# Altium project C210 Rev_B_220601.PrjPcb (part 2 of 5)

## Sheet C210_0003_SARA_Module_220601.SchDoc: C210_0003_SARA_Module
size B; Date: 2/26/2021; CompanyName: U-blox; DrawnBy: EMOO; Engineer: EMOO; Organization: U-blox; Address1: 2601 25th St. SE; Address2: Salem, OR 97302; SheetNumber: 3; SheetTotal: 7; Website: www.u-blox.com; SheetSize: B; SheetTitle: C-210 SARA Module
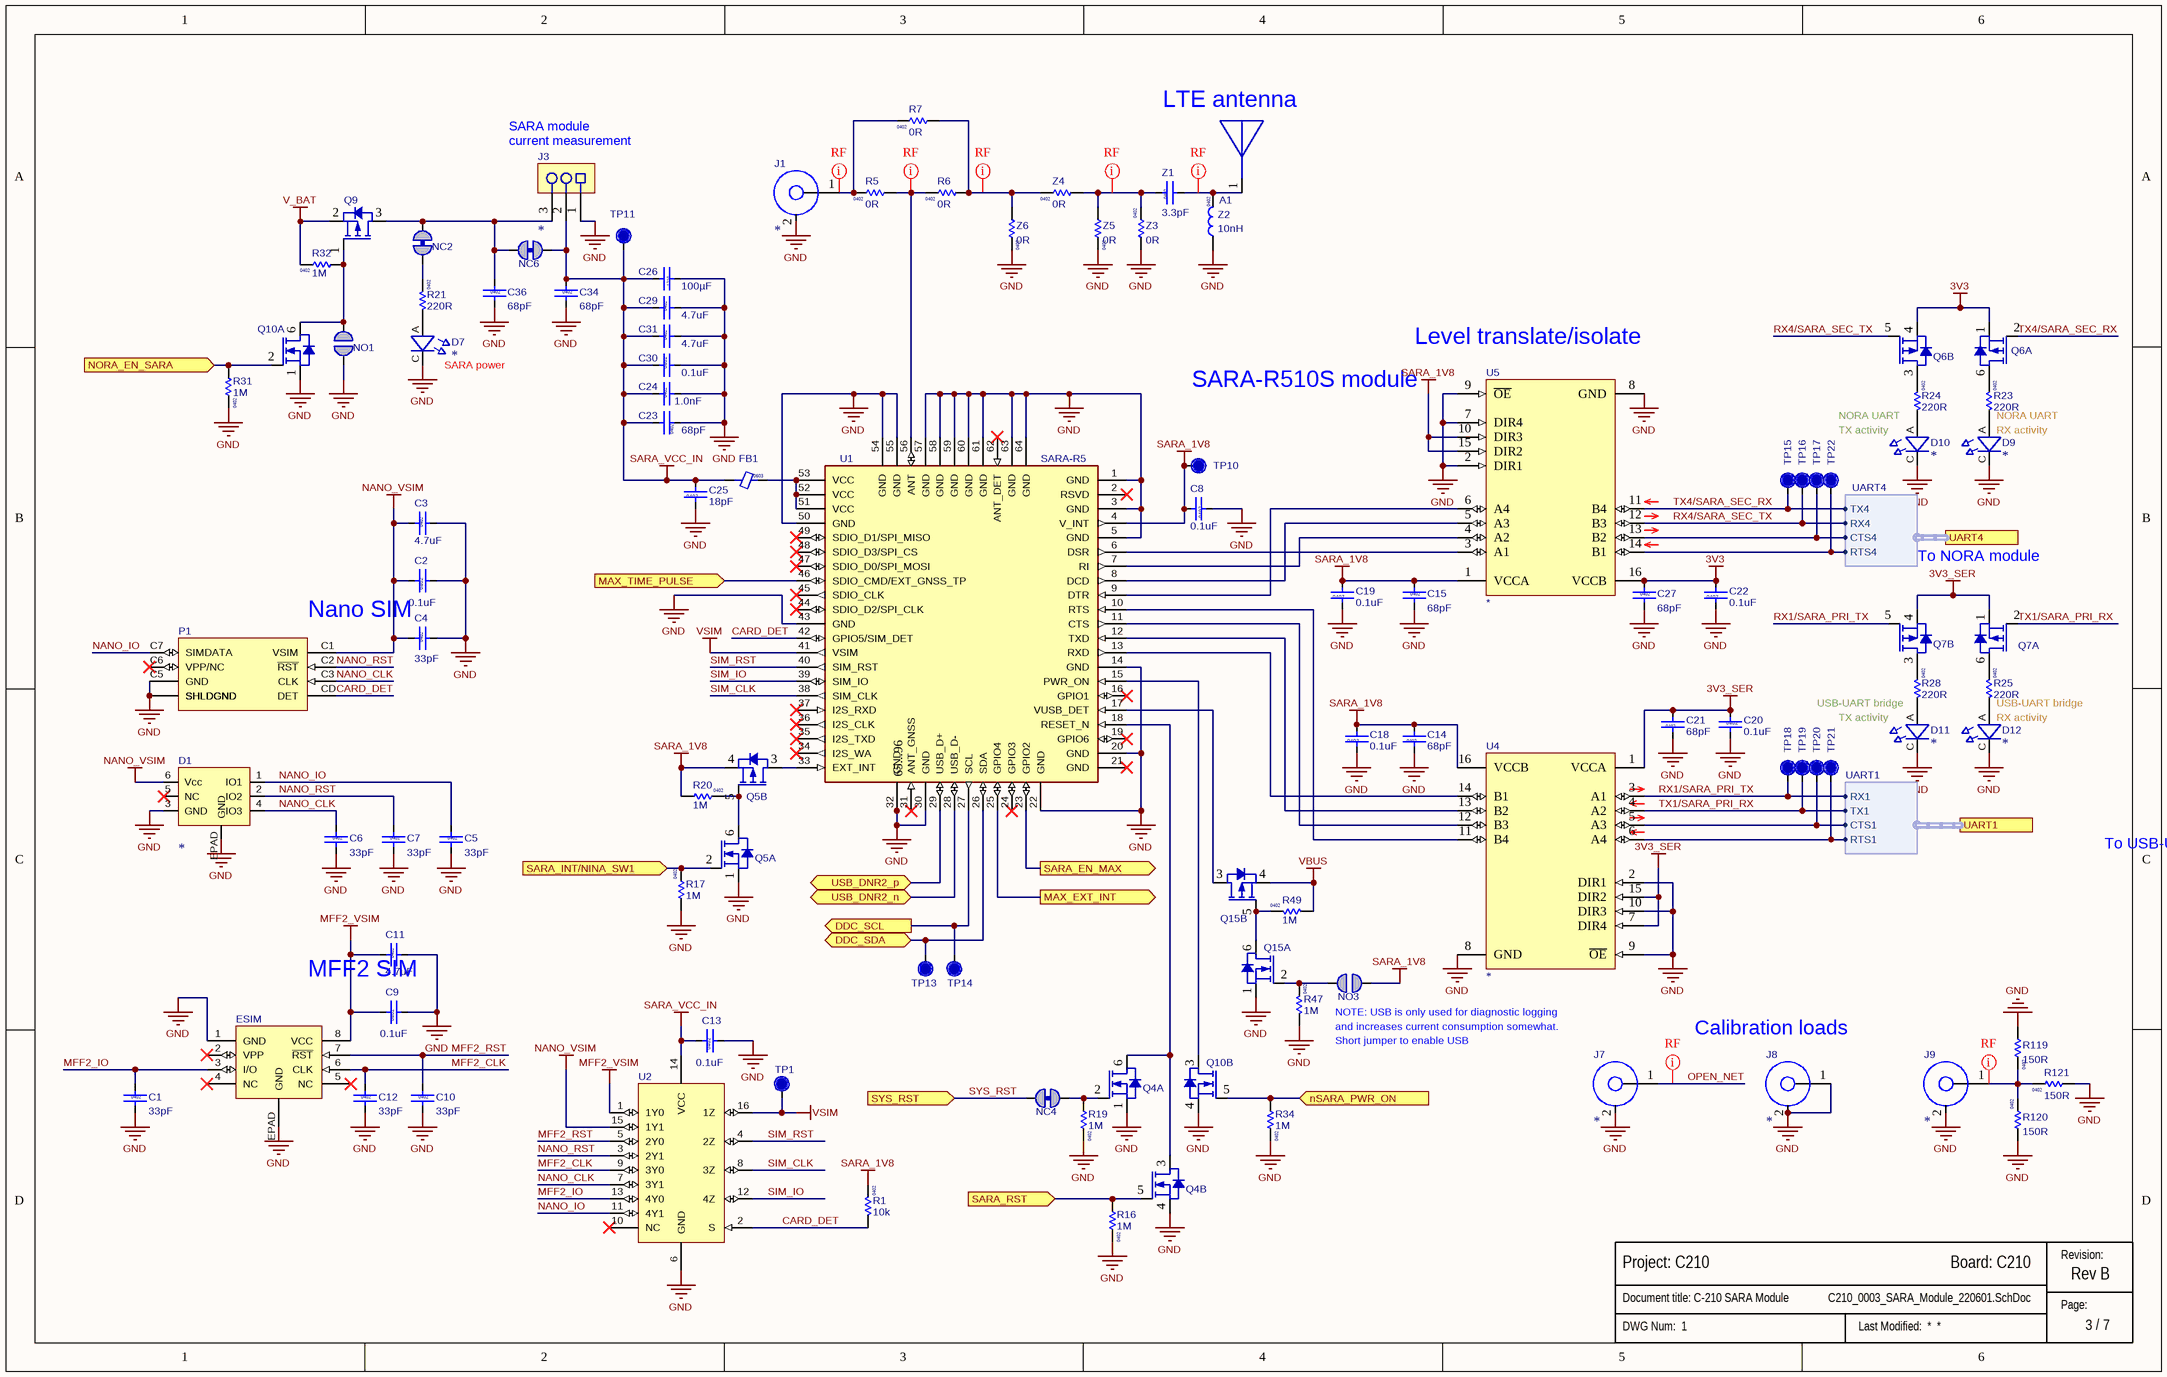
[diagram p2: C210_0003_SARA_Module_220601.SchDoc]

### Parts
(Parts that share a designator on the sheet are numbered #1, #2 ... from top to bottom, then left to right.)
?#4  (no value)  (graphical)
A1  PCS.66.A  [PCS_66_A]  (value not drawn)
C1  value 33pF  Size: 0402  [Cap 0402 HD]
C2  value 0.1uF  Size: 0402  [Cap 0402 HD]  (hidden comment: 120-000160.1uF)
C3  value 4.7uF  Size: 0402  [Cap 0402 HD]
C4  value 33pF  Size: 0402  [Cap 0402 HD]
C5  value 33pF  Size: 0402  [Cap 0402 HD]
C6  value 33pF  Size: 0402  [Cap 0402 HD]
C7  value 33pF  Size: 0402  [Cap 0402 HD]
C8  value 0.1uF  Size: 0402  [Cap 0402 HD]  (hidden comment: 120-000160.1uF)
C9  value 0.1uF  Size: 0402  [Cap 0402 HD]  (hidden comment: 120-000160.1uF)
C10  value 33pF  Size: 0402  [Cap 0402 HD]
C11  value 4.7uF  Size: 0402  [Cap 0402 HD]
C12  value 33pF  Size: 0402  [Cap 0402 HD]
C13  value 0.1uF  Size: 0402  [Cap 0402 HD]  (hidden comment: 120-000160.1uF)
C14  value 68pF  Size: 0402  [Cap 0402 HD]
C15  value 68pF  Size: 0402  [Cap 0402 HD]
C18  value 0.1uF  Size: 0402  [Cap 0402 HD]  (hidden comment: 120-000160.1uF)
C19  value 0.1uF  Size: 0402  [Cap 0402 HD]  (hidden comment: 120-000160.1uF)
C20  value 0.1uF  Size: 0402  [Cap 0402 HD]  (hidden comment: 120-000160.1uF)
C21  value 68pF  Size: 0402  [Cap 0402 HD]
C22  value 0.1uF  Size: 0402  [Cap 0402 HD]  (hidden comment: 120-000160.1uF)
C23  value 68pF  Size: 0402  [Cap 0402 HD]
C24  value 1.0nF  Size: 0402  [Cap 0402 HD]
C25  value 18pF  Size: 0402  [Cap 0402 HD]
C26  value 100µF  Size: 1210  [Cap 1210]
C27  value 68pF  Size: 0402  [Cap 0402 HD]
C29  value 4.7uF  Size: 0402  [Cap 0402 HD]
C30  value 0.1uF  Size: 0402  [Cap 0402 HD]  (hidden comment: 120-000160.1uF)
C31  value 4.7uF  Size: 0402  [Cap 0402 HD]
C34  value 68pF  Size: 0402  [Cap 0402 HD]
C36  value 68pF  Size: 0402  [Cap 0402 HD]
D1  (no value)  [TPD3E001DRSR]
D7  (no value)  [LTST-C190EKT]
D9  (no value)  [LTST-C190YKT]
D10  (no value)  [LTST-C190KGKT]
D11  (no value)  [LTST-C190KGKT]
D12  (no value)  [LTST-C190YKT]
ESIM  (no value)  [MFF2 SIM]
FB1  Size: 0603  [BLM18EG221SN1]
J1  (no value)  [U.FL_3Pin]
J3  (no value)  [HDR-0.1P-3Pin-1Row-SMT]
J7  (no value)  [U.FL_3Pin]
J8  (no value)  [U.FL_3Pin]
J9  (no value)  [U.FL_3Pin]
NC2  Solderbridge-ShortDNP  [Solderbridge-Short]  (value not drawn)  (net tie, no BOM)
NC4  Solderbridge-ShortDNP  [Solderbridge-Short]  (value not drawn)  (net tie, no BOM)
NC6  Solderbridge-ShortDNP  [Solderbridge-Short]  (value not drawn)  (net tie, no BOM)
NO1  Solderbridge-OpenDNP  [Solderbridge-Open]  (value not drawn)  (no BOM)
NO3  Solderbridge-OpenDNP  [Solderbridge-Open]  (value not drawn)  (no BOM)
P1  (no value)  [SIM6065-6-1-14-01-A]
Q4  (no value)  [SOT-563]  (parts A,B of 2)
Q5  (no value)  [SOT-563]  (parts A,B of 2)
Q6  (no value)  [FDY2000PZ]  (parts A,B of 2)
Q7  (no value)  [FDY2000PZ]  (parts A,B of 2)
Q9  (no value)  [SOT-23]
Q10  (no value)  [SOT-563]  (parts A,B of 2)
Q15  (no value)  [SOT-563]  (parts A,B of 2)
R1  value 10k  Size: 0402  [RES 0402 HD]
R5  value 0R  Size: 0402  [RES 0402 HD]
R6  value 0R  Size: 0402  [RES 0402 HD]
R7  value 0R  Size: 0402  [RES 0402 HD]
R16  value 1M  Size: 0402  [RES 0402 HD]
R17  value 1M  Size: 0402  [RES 0402 HD]
R19  value 1M  Size: 0402  [RES 0402 HD]
R20  value 1M  Size: 0402  [RES 0402 HD]
R21  value 220R  Size: 0402  [RES 0402 HD]
R23  value 220R  Size: 0402  [RES 0402 HD]
R24  value 220R  Size: 0402  [RES 0402 HD]
R25  value 220R  Size: 0402  [RES 0402 HD]
R28  value 220R  Size: 0402  [RES 0402 HD]
R31  value 1M  Size: 0402  [RES 0402 HD]
R32  value 1M  Size: 0402  [RES 0402 HD]
R34  value 1M  Size: 0402  [RES 0402 HD]
R47  value 1M  Size: 0402  [RES 0402 HD]
R49  value 1M  Size: 0402  [RES 0402 HD]
R119  value 150R  Size: 0402  [RES 0402 HD]
R120  value 150R  Size: 0402  [RES 0402 HD]
R121  value 150R  Size: 0402  [RES 0402 HD]
TP1  TP  [TP12R]  (value not drawn)  (no BOM)
TP10  TP  [TP12R]  (value not drawn)  (no BOM)
TP11  TP  [TP12R]  (value not drawn)  (no BOM)
TP13  TP  [TP12R]  (value not drawn)  (no BOM)
TP14  TP  [TP12R]  (value not drawn)  (no BOM)
TP15  TP  [TP12R]  (value not drawn)  (no BOM)
TP16  TP  [TP12R]  (value not drawn)  (no BOM)
TP17  TP  [TP12R]  (value not drawn)  (no BOM)
TP18  TP  [TP12R]  (value not drawn)  (no BOM)
TP19  TP  [TP12R]  (value not drawn)  (no BOM)
TP20  TP  [TP12R]  (value not drawn)  (no BOM)
TP21  TP  [TP12R]  (value not drawn)  (no BOM)
TP22  TP  [TP12R]  (value not drawn)  (no BOM)
U1  SARA-R5  [SARA-XX]
U2  (no value)  [XQFN-16]
U4  (no value)  [QFN0.5P2x6-16Pin_W-Pad]
U5  (no value)  [QFN0.5P2x6-16Pin_W-Pad]
Z1  value 3.3pF  Size: 0402  [Cap 0402 HD]
Z2  value 10nH  Size: 0402  [IND 0402]
Z3  value 0R  Size: 0402  [RES 0402 HD]
Z4  value 0R  Size: 0402  [RES 0402 HD]
Z5  value 0R  Size: 0402  [RES 0402 HD]
Z6  value 0R  Size: 0402  [RES 0402 HD]

### Ports
DDC_SCL (out), DDC_SDA (bidir), MAX_EXT_INT (out), MAX_TIME_PULSE (in), NORA_EN_SARA (in), nSARA_PWR_ON (in), SARA_EN_MAX (out), SARA_INT/NINA_SW1 (in), SARA_RST (in), SYS_RST (in), UART1 (harness UART1), UART4 (harness UART4), USB_DNR2_n (bidir), USB_DNR2_p (bidir)

### Harnesses
UART4: TX4, RX4, RTS4, CTS4
UART1: TX1, RX1, RTS1, CTS1

### Nets
3V3: C22.2 C27.1 Q6.1(S1) Q6.4(S2) U5.16(VCCB)
3V3_SER: C20.1 C21.2 Q7.1(S1) Q7.4(S2) U4.1(VCCA) U4.7(DIR4) U4.15(DIR2)
GND: C1.2 C2.2 C3.2 C4.2 C5.2 C6.2 C7.2 C8.1 C9.2 C10.2 C11.2 C12.2 C13.2 C14.1 C15.2 C18.1 C19.1 C20.2 C21.1 C22.1 C23.1 C24.2 C25.1 C26.1 C27.2 C29.2 C30.2 C31.2 C34.2 C36.2 D1.3(GND) D1.EPAD(GND) D7.C(Cathode) D9.C(Cathode) D10.C(Cathode) D11.C(Cathode) D12.C(Cathode) ESIM.1(GND) ESIM.EPAD(GND) J1.2 J3.1 J7.2 J8.1(ANT) J8.2 J9.2 NO1.2 P1.C5(GND) P1.G1(SHLDGND) P1.G2(SHLDGND) P1.G3(SHLDGND) P1.G4(SHLDGND) Q4.1(S1) Q4.4(S2) Q5.1(S1) Q10.1(S1) Q10.4(S2) Q15.1(S1) R16.2 R17.1 R19.2 R31.2 R34.2 R47.1 R119.1 R120.1 R121.1 U1.1(GND) U1.3(GND) U1.5(GND) U1.14(GND) U1.20(GND) U1.22(GND) U1.30(GND) U1.32(GND) U1.43(GND) U1.50(GND) U1.54(GND) U1.55(GND) U1.57(GND) U1.58(GND) U1.59(GND) U1.60(GND) U1.61(GND) U1.63(GND) U1.64(GND) U1.65(GND) U1.66(GND) U1.67(GND) U1.68(GND) U1.69(GND) U1.70(GND) U1.71(GND) U1.72(GND) U1.73(GND) U1.74(GND) U1.75(GND) U1.76(GND) U1.77(GND) U1.78(GND) U1.79(GND) U1.80(GND) U1.81(GND) U1.82(GND) U1.83(GND) U1.84(GND) U1.85(GND) U1.86(GND) U1.87(GND) U1.88(GND) U1.89(GND) U1.90(GND) U1.91(GND) U1.92(GND) U1.93(GND) U1.94(GND) U1.95(GND) U1.96(GND) U2.6(GND) U4.2(DIR1) U4.8(GND) U4.9(~{OE}) U4.10(DIR3) U5.2(DIR1) U5.7(DIR4) U5.8(GND) U5.9(~{OE}) Z2.1 Z3.1 Z5.2 Z6.2
MFF2_VSIM: C9.1 C11.1 ESIM.8(VCC) U2.1(1Y0)
NANO_VSIM: C2.1 C3.1 C4.1 D1.6(Vcc) P1.C1(VSIM) U2.15(1Y1)
SARA_1V8: C8.2 C14.2 C15.1 C18.2 C19.2 NO3.2 Q5.4(S2) R1.2 R20.1 TP10.1 U1.4(V_INT) U4.16(VCCB) U5.1(VCCA) U5.10(DIR3) U5.15(DIR2)
SARA_VCC_IN: C13.1 C23.2 C24.1 C25.2 C26.2 C29.1 C30.1 C31.1 C34.1 FB1.1 J3.2 NC6.1 TP11.1 U2.14(VCC)
V_BAT: Q9.2(S) R32.2
VBUS: Q15.4(S2) R49.1
VSIM: TP1.1 U1.41(VSIM) U2.16(1Z)
CARD_DET: P1.CD(DET) R1.1 U1.42(GPIO5/SIM_DET) U2.2(S)
CTS4: TP17.1 U5.13(B2) ; port UART4.CTS4
MFF2_CLK: C12.1 ESIM.6(CLK) U2.9(3Y0)
MFF2_IO: C1.1 ESIM.3(I/O) U2.13(4Y0)
MFF2_RST: C10.1 ESIM.7(~{RST}) U2.5(2Y0)
NANO_CLK: C6.1 D1.4(IO3) P1.C3(CLK) U2.7(3Y1)
NANO_IO: C5.1 D1.1(IO1) P1.C7(SIMDATA) U2.11(4Y1)
NANO_RST: C7.1 D1.2(IO2) P1.C2(~{RST}) U2.3(2Y1)
OPEN_NET: J7.1(ANT)
RTS4: TP22.1 U5.14(B1) ; port UART4.RTS4
RX1/SARA_PRI_TX: Q7.5(G2) TP18.1 U4.3(A1) ; port UART1.RX1
RX4/SARA_SEC_TX: Q6.5(G2) TP16.1 U5.12(B3) ; port UART4.RX4  [project net RX4]
SIM_CLK: U1.38(SIM_CLK) U2.8(3Z)
SIM_IO: U1.39(SIM_IO) U2.12(4Z)
SIM_RST: U1.40(SIM_RST) U2.4(2Z)
SYS_RST: NC4.2 ; port SYS_RST
TX1/SARA_PRI_RX: Q7.2(G1) TP19.1 U4.4(A2) ; port UART1.TX1
TX4/SARA_SEC_RX: Q6.2(G1) TP15.1 U5.11(B4) ; port UART4.TX4  [project net TX4]
USB_DNR2_n: U1.28(USB_D-) ; port USB_DNR2_n
USB_DNR2_p: U1.29(USB_D+) ; port USB_DNR2_p
NetA1_1: A1.1 Z1.2 Z2.2
NetC36_1: C36.1 J3.3 NC2.1 NC6.2 Q9.3(D)
NetD7_A: D7.A(Anode) R21.1
NetD9_A: D9.A(Anode) R23.1
NetD10_A: D10.A(Anode) R24.1
NetD11_A: D11.A(Anode) R28.1
NetD12_A: D12.A(Anode) R25.1
NetFB1_2: FB1.2 U1.51(VCC) U1.52(VCC) U1.53(VCC)
NetJ1_1: J1.1(ANT) R5.2 R7.2
NetJ9_1: J9.1(ANT) R119.2 R120.2 R121.2
NetNC2_2: NC2.2 R21.2
NetNC4_1: NC4.1 Q4.2(G1) R19.1
NetNO1_1: NO1.1 Q9.1(G) Q10.6(D1) R32.1
NetNO3_1: NO3.1 Q15.2(G1) R47.2
NetQ1_2: Q5.2(G1) R17.2 ; port SARA_INT/NINA_SW1
NetQ4_3: Q4.3(D2) Q4.6(D1) U1.18(RESET_N)
NetQ4_5: Q4.5(G2) R16.1 ; port SARA_RST
NetQ5_3: Q5.3(D2) U1.33(EXT_INT)
NetQ5_5: Q5.5(G2) Q5.6(D1) R20.2
NetQ6_3: Q6.3(D2) R24.2
NetQ6_6: Q6.6(D1) R23.2
NetQ7_3: Q7.3(D2) R28.2
NetQ7_6: Q7.6(D1) R25.2
NetQ10_2: Q10.2(G1) R31.1 ; port NORA_EN_SARA
NetQ10_3: Q10.3(D2) U1.15(PWR_ON)
NetQ10_5: Q10.5(G2) R34.1 ; port nSARA_PWR_ON
NetQ15_3: Q15.3(D2) U1.17(VUSB_DET)
NetQ15_5: Q15.5(G2) Q15.6(D1) R49.2
NetQ27_2: U1.23(GPIO2) ; port SARA_EN_MAX
NetR5_1: R5.1 R6.2 U1.56(ANT)
NetR6_1: R6.1 R7.1 Z4.2 Z6.1
NetR18_2: U1.46(SDIO_CMD/EXT_GNSS_TP) ; port MAX_TIME_PULSE
NetTP13_1: TP13.1 U1.26(SDA) ; port DDC_SDA
NetTP14_1: TP14.1 U1.27(SCL) ; port DDC_SCL
NetTP20_1: TP20.1 U4.5(A3) ; port UART1.CTS1
NetTP21_1: TP21.1 U4.6(A4) ; port UART1.RTS1
NetU1_6: U1.6(DSR) U5.3(A1)
NetU1_7: U1.7(RI) U5.4(A2)
NetU1_8: U1.8(DCD) U5.5(A3)
NetU1_9: U1.9(DTR) U5.6(A4)
NetU1_10: U1.10(RTS) U4.11(B4)
NetU1_11: U1.11(CTS) U4.12(B3)
NetU1_12: U1.12(TXD) U4.13(B2)
NetU1_13: U1.13(RXD) U4.14(B1)
NetU1_25: U1.25(GPIO4) ; port MAX_EXT_INT
NetZ1_1: Z1.1 Z3.2 Z4.1 Z5.1

Not connected (* = marked no-connect by the designer): D1 5(NC)*; ESIM 2(VPP)* 4(NC)* 5(NC)*; P1 C6(VPP/NC)*; U1 2(RSVD)* 16(GPIO1)* 19(GPIO6)* 21(GND)* 24(GPIO3)* 31(ANT_GNSS)* 34(I2S_WA)* 35(I2S_TXD)* 36(I2S_CLK)* 37(I2S_RXD)* 44(SDIO_D2/SPI_CLK)* 45(SDIO_CLK)* 47(SDIO_D0/SPI_MOSI)* 48(SDIO_D3/SPI_CS)* 49(SDIO_D1/SPI_MISO)* 62(ANT_DET)*; U2 10(NC)*

### Layout directives
net class RF: NetA1_1, NetJ1_1, NetJ9_1, NetR5_1, NetR6_1, NetZ1_1, OPEN_NET

### Notes on the sheet
- LTE antenna
- SARA module
- (near J3) current measurement
- (near D7) SARA power
- SARA-R510S module
- (near U5) Level translate/isolate
- TX activity
- NORA UART
- (near D9) RX activity
- (near R23) NORA UART
- To NORA module
- (near P1) Nano SIM
- USB-UART bridge
- (near D12) RX activity
- (near R25) USB-UART bridge
- To USB-UART bridge
- MFF2 SIM
- NOTE: USB is only used for diagnostic logging
- and increases current consumption somewhat.
- (near J8) Calibration loads
- Short jumper to enable USB
- Revision:
- Page:
- (in symbol SARA-R5) 65...96

### Library data of the parts
?#4 = Sub_Title_Block: as ?#3 on sheet C210_0002_NORA_Module_220601
A1 = PCS.66.A: RF Passive, Antenna, LTE, 600-6000MHz, Monopole; Manufacturer 1: Taoglas; Body Size: 33mm x 25mm; Item Phase: Unreleased; MFG Package: Custom; RF Freq: 698-2700 MHz; SMT Pitch: None; Use in new designs: Yes; Part Number: PCS.66.A; Manufacturer Part Number 1: PCS.66.A; Height: 1.6mm; Max Operating Temp: 85; Min Operating Temp: -40; Pins: 5; Revision: None; Size: Other; Voltage: None; UBX Code: None; Manufacturer 2: None; Manufacturer Part Number 2: None; Supplier 2: None; Supplier Part Number 2: None
C1 C4-C7 C10 C12 = 120-00045: Cap, Ceramic,  33pF, 50V, 5%, NPO, 0402; Manufacturer 1: Samsung Electro-Mechanics America, Inc; Manufacturer Part Number 1: CL05C330JB5NNNC; Part Name: CAP CER 33PF 50V 5% NP0 0402; Item Phase: In Production; Temperature Coefficient: NP0; Tolerance: +/- 5%; Use in new designs: Yes; UBX Code: None; Part Number: 120-00045; Supplier 1: Digi-Key; Supplier Part Number 1: 1276-1272-1-ND; Manufacturer 2: Murata Electronics North America; Manufacturer Part Number 2: GRM1555C1H330JA01D; Supplier 2: Digi-Key; Supplier Part Number 2: 490-5936-1-ND; Height: 0.55mm; Max Operating Temp: 125; Min Operating Temp: -55; Pins: 2; Revision: 0A; Voltage: 50V
C2 C8 C9 C13 C18-C20 C22 C30 = 120-00016: as C39 on sheet C210_0002_NORA_Module_220601; Part Number: 120-00016; Revision: 0A; Supplier 1: Digi-Key; Supplier Part Number 1: 490-6297-1-ND; Manufacturer 2: Yageo; Manufacturer P/N 2: CC0402KRX5R6BB104; Supplier 2: Digi-Key; Supplier Part Number 2: 311-1336-1-ND; Arena Link: https://app.bom.com/a/GYHPV2L2L43KRMBK?v=spec.summary; Height: 0.55mm; Pins: 2; Temperature Coefficient: X5R; Voltage: 10V
C3 C11 C29 C31 = 120-00020: Cap, Ceramic 4.7uF 10V 20% X5R 0402; Manufacturer 1: Samsung Electro-Mechanics America, Inc; Manufacturer Part Number 1: CL05A475MP5NRNC; Part Name: CAP CER 4.7uF 10V 20% X5R 0402; Item Phase: In Production; Tolerance: +/- 20%; Use in new designs: Yes; UBX Code: None; Part Number: 120-00020; Supplier 1: Digi-Key; Supplier Part Number 1: 1276-1482-1-ND; Manufacturer 2: Yageo; Manufacturer Part Number 2: CC0402KRX5R6BB475; Supplier 2: Digi-Key; Supplier Part Number 2: 311-3477-1-ND; Height: 0.55mm; Max Operating Temp: 85; Min Operating Temp: -55; Pins: 2; Revision: 0C; Temperature Coefficient: X5R; Voltage: 10V
C14 C15 C21 C23 C27 C34 C36 = 120-00047: as C82 on sheet C210_0002_NORA_Module_220601; Part Number: 120-00047; Supplier 1: Digi-Key; Supplier Part Number 1: 490-8219-1-ND; Manufacturer 2: AVX Corporation; Manufacturer Part Number 2: 04025A680FAT2A; Supplier 2: Digi-Key; Supplier Part Number 2: 478-7881-1-ND; Height: 0.55mm; Max Operating Temp: 125; Min Operating Temp: -55; Pins: 2; Revision: None; Temperature Coefficient: NP0; Voltage: 50V
C24 = 120-00010: CAP CER 1.0nF 50V 10% X7R 0402; Manufacturer 1: TDK Corporation; Manufacturer Part Number 1: C1005X7R1H102K050BE; Item Phase: In Production; Tolerance: +/- 10%; Use in new designs: Yes; UBX Code: None; Part Number: 120-00010; Supplier 1: Digi-Key; Supplier Part Number 1: 445-173622-1-ND; Manufacturer 2: Kemet; Manufacturer Part Number 2: C0402C102K5RACTU; Supplier 2: Digi-Key; Supplier Part Number 2: 399-1032-1-ND; Height: 0.55mm; Max Operating Temp: 125; Min Operating Temp: -55; Part Name: CAP CER 1.0NF 50V 10% X7R 0402; Pins: 2; Revision: 0D; Temperature Coefficient: X7R; Voltage: 50V
C25 = 120-00041: Cap, Ceramic 18pF 50V 5% NP0 0402; Manufacturer 1: NIC Components Inc; Manufacturer Part Number 1: NMC0402NPO180J50TRPF; Part Name: CAP CER 18PF 50V 5% NP0 0402; Item Phase: In Production; Tolerance: +/- 5%; Use in new designs: Yes; UBX Code: None; Part Number: 120-00041; Supplier 1: Arrow; Supplier Part Number 1: NMC0402NPO180J50TRPF; Manufacturer 2: CCK; Manufacturer Part Number 2: CCK0402NPO5J180PL; Supplier 2: None; Supplier Part Number 2: None; Height: 0.55mm; Max Operating Temp: 125; Min Operating Temp: -55; Pins: 2; Revision: 0C; Temperature Coefficient: NP0; Voltage: 50V
C26 = 120-00223: 100µF ±20% 10V Ceramic Capacitor X5R 1210 (3225 Metric); Manufacturer 1: Samsung Electro-Mechanics America, Inc.; Manufacturer Part Number 1: CL32A107MPVNNNE; Part Name: CAP CER 100UF 10V 20% X5R 1210; Item Phase: In Production; Tolerance: +/- 20%; Use in new designs: Yes; UBX Code: None; Part Number: 120-00223; Supplier 1: Future Electronics; Supplier Part Number 1: Samsung Electro-Mechanics America, Inc. CL32A107MPVNNNE; Manufacturer 2: None; Manufacturer Part Number 2: None; Supplier 2: None; Supplier Part Number 2: None; Height: 2.8mm; Max Operating Temp: 85; Min Operating Temp: -55; Pins: 2; Revision: 0A; Temperature Coefficient: X5R; Voltage: 10V
D1 = TPD3E001: TVS Diode, ESD High Speed 3-Channel Array, WSON-6, 3mmX3mm; Manufacturer 1: Texas Instruments; Part Name: Diode TVS 5V 3CH WSON-6; Current: None; Item Phase: In Production; MFG Package: WSON-6, DRS (S-PWSON-N6); Use in new designs: Yes; Voltage: 5.5V; Manufacturer Part Number 1: TPD3E001DRSR; Manufacturer 2: None; Manufacturer Part Number 2: None; Supplier 2: None; Supplier Part Number 2: None; Body Size: 3mm x 3mm; Height: 0.80mm; Max Operating Temp: 85; Min Operating Temp: -40; Pins: 6; Revision: 0A; UBX Code: None; Manufacturer P/N: *
D7 = LTST-C190EKT: DIODE, LED, SMT, Red, CLEAR LENS, 2.0V 10mA, 0603; Manufacturer 1: Lite-On Inc; Part Name: LED Red SMT 0603; Body Size: 1.60mm x 0.80mm; Item Phase: In Production; MFG Package: None; Use in new designs: Yes; Part Number: LTST-C190EKT; Manufacturer Part Number 1: LTST-C190EKT; Supplier 1: Digi-Key; Supplier Part Number 1: 160-1182-2-ND; Current: 10mA; Height: 0.80mm; Max Operating Temp: 85; Min Operating Temp: -30; Pins: 2; Revision: 0A; Size: 0603; Voltage: 2.0V; UBX Code: None; Manufacturer 2: None; Manufacturer Part Number 2: None; Supplier 2: None; Supplier Part Number 2: None; Color: *
D9 D12 = LTST-C190YKT: as D14 on sheet C210_0002_NORA_Module_220601; Part Number: LTST-C190YKT; Manufacturer Part Number 1: LTST-C190YKT; Supplier 1: Digi-Key; Supplier Part Number 1: 160-1184-2-ND; Current: 10mA; Height: 0.80mm; Max Operating Temp: 85; Min Operating Temp: -30; Pins: 2; Revision: 0A; Size: 0603; Voltage: 2.1V; UBX Code: None; Manufacturer 2: None; Manufacturer Part Number 2: None; Supplier 2: None; Supplier Part Number 2: None; Color: *
D10 D11 = LTST-C190KGKT: as D13 on sheet C210_0002_NORA_Module_220601; Manufacturer Part Number 1: LTST-C190KGKT; Supplier 1: Digi-Key; Supplier Part Number 1: 160-1435-2-ND; Current: 20mA; Height: 0.80mm; Max Operating Temp: 85; Min Operating Temp: -30; Pins: 2; Revision: 0A; Size: 0603; Voltage: 2.0V; UBX Code: None; Manufacturer 2: None; Manufacturer Part Number 2: None; Supplier 2: None; Supplier Part Number 2: None; Color: *
ESIM = MFF2 SIM: ESIM, SMT, MFF2, 1.8V, SMT, VFDFPN8, 5mmX6mm; Manufacturer 1: Generic; Current: None; Item Phase: In Production; Use in new designs: Yes; Part Number: MFF2 SIM; Manufacturer Part Number 1: ESIM; Body Size: 5mm x 6mm; Height: 1mm; MFG Package: VFDFPN8; Max Operating Temp: 85; Min Operating Temp: -40; Part Name: ESIM; Pins: 12; Revision: 0A; Voltage: 1.8V; UBX Code: None
FB1 = BLM18EG221SN1: Ferrite Bead, 220ohm @ 100MHz, 2A, 0603; Manufacturer 1: Murata Electronics North America; Manufacturer Part Number 1: BLM18EG221SN1D; Part Name: Ferrite Bead 220ohm 2A 0503; Body Size: None; Item Phase: Unreleased; Use in new designs: Yes; Value: None; Part Number: BLM18EG221SN1; Supplier 1: Digi-Key; Supplier Part Number 1: 490-3992-2-ND; Current: 2A; Height: 0.8mm; MFG Package: None; Max Operating Temp: 85; Min Operating Temp: -55; Pins: None; Revision: None; Voltage: None; Manufacturer 2: None; Manufacturer Part Number 2: None; Supplier 2: None; Supplier Part Number 2: None; UBX Code: None
J1 J7-J9 = 130-00067: U.FL jack, SMA 50 ohm, 3 pin, SMT; Manufacturer 1: Hirose Electric Co Ltd; Manufacturer Part Number 1: U.FL-R-SMT(10); Part Name: CON RF UMC U.FL Jack 3Pin SMT; Item Phase: In Production; Use in new designs: Yes; Voltage: None; UBX Code: UBXH04-0001026; Manufacturer P/N: *; Part Number: 130-00067; Supplier 1: Digi-Key; Supplier Part Number 1: H9161CT-ND; Diameter: None; Height: 1.25mm; Max Operating Temp: 90; Min Operating Temp: -40; Pins: 3; Revision: 0A; Manufacturer 2: Dongguan Qintai Electronics Co, Ltd.; Manufacturer Part Number 2: MHF-RT-1; Supplier 2: Rayson Technology co., ltd; Supplier Part Number 2: MHF-RT-1
J3 = 130-00105: as J4 on sheet C210_0002_NORA_Module_220601; Manufacturer P/N: *; Part Number: 130-00105; Supplier 1: Digi-Key; Supplier Part Number 1: 952-1951-ND; Diameter: None; Height: 9.93mm; Max Operating Temp: None; Min Operating Temp: None; Pins: 3; Revision: 0C; UBX Code: None; Manufacturer 2: Greenconn Corporation; Manufacturer Part Number 2: GPHC1010302A081B1BD; Supplier 2: Teamwise Limited; Supplier Part Number 2: Greenconn Corporation GPHC1010302A081B1BD
NC2 NC4 NC6 = Solderbridge-Short: Added By: Paul B; Part Number: Solderbridge-Short; Height: 0; DNP: DNP; Added Date: 12/2/2015
NO1 NO3 = Solderbridge-Open: Added By: Paul B; Part Number: Solderbridge-Open; Height: 0; DNP: DNP; Added Date: 12/2/2015
P1 = SIM8065: NANO SIM SOCKET, SWITCH, SMT, PUSH-PUSH, 13mmX14mm; Manufacturer 1: GCT; Manufacturer Part Number 1: SIM8065-6-1-14-01-A; Current: 1A; Item Phase: In Production; MFG Package: Custom; Use in new designs: Yes; Voltage: 30V; UBX Code: None; Part Number: SIM8065; Body Size: 13mm x 14mm; Height: 1.25mm; Max Operating Temp: 85; Min Operating Temp: -40; Part Name: SIM8065; Pins: 11; Revision: 0A
Q4 Q10 = 140-00016: as Q16 on sheet C210_0002_NORA_Module_220601; Part Number: 140-00016; Supplier 1: Digi-Key; Supplier Part Number 1: SSM6N56FELMCT-ND; Height: 0.6mm; MFG Package: SOT-563; Max Operating Temp: 150; Min Operating Temp: -55; Pins: 6; Revision: 0A; Voltage: 20V; Manufacturer 2: None; Manufacturer Part Number 2: None; Supplier 2: None; Supplier Part Number 2: None
Q5 Q15 = 140-00030: as Q18 on sheet C210_0002_NORA_Module_220601; Part Number: 140-00030; Supplier 1: Digi-Key; Supplier Part Number 1: NTZD3155CT2GOSCT-ND; Current: 540 mA, −430 mA; Height: 0.6mm; MFG Package: SOT-563; Max Operating Temp: 150; Min Operating Temp: -55; Part Name: MOSFET N/P-CH 20V SOT-563; Pins: 6; Revision: 0A; Voltage: 20V; Manufacturer 2: None; Manufacturer Part Number 2: None; Supplier 2: None; Supplier Part Number 2: None
Q6 Q7 = FDY2000PZ: as Q12 on sheet C210_0002_NORA_Module_220601; Part Number: FDY2000PZ; Manufacturer Part Number 1: FDY2000PZ; Supplier 1: Digi-Key; Supplier Part Number 1: 2156-FDY2000PZ-ND; Current: -350mA; Height: 0.6mm; MFG Package: SOT-563; Max Operating Temp: 150; Min Operating Temp: -55; Part Name: MOSFET DUAL P-CH 20V SOT-563; Pins: 6; Revision: 0A; Voltage: 20V; Manufacturer 2: None; Manufacturer Part Number 2: None; Supplier 2: None; Supplier Part Number 2: None
Q9 = 140-00008: P-MOSFET, 20V 3.1A, SOT-23; Manufacturer 1: Vishay Siliconix; Manufacturer Part Number 1: SI2301CDS-T1-GE3; Part Name: Si2301CDS; Body Size: None; Item Phase: In Production; Transistor Type: P-Channel; MFG Package: SOT23; Use in new designs: Yes; Part Number: 140-00008; Supplier 1: Digi-Key; Supplier Part Number 1: SI2301CDS-T1-GE3CT-ND; Current: 3.1A; Height: None; Max Operating Temp: 150; Min Operating Temp: -55; Pins: 3; Revision: 0B; Thermal Pad: None; Voltage: 20V; UBX Code: None; Manufacturer 2: None; Manufacturer Part Number 2: None; Supplier 2: None; Supplier Part Number 2: None
R1 = 180-00024: Resistor 10k ohm 1% 1/16W, 0402; Manufacturer 1: Samsung Electro-Mechanics America, Inc; Manufacturer Part Number 1: RC1005F103CS; Part Name: RES SMD 10K OHM 1% 1/16W 0402; Item Phase: In Production; Tolerance: +/- 1%; Use in new designs: Yes; UBX Code: None; Part Number: 180-00024; Supplier 1: Digi-Key; Supplier Part Number 1: 1276-3431-1-ND; Manufacturer 2: Hong Kong Resistors Manufactory; Manufacturer Part Number 2: RCT0210KFLF; Supplier 2: None; Supplier Part Number 2: None; Height: 0.4mm; Max Operating Temp: 155; Min Operating Temp: -55; Pins: 2; Power: 1/16W; Revision: 0E; Voltage: N/A
R5-R7 Z3-Z6 = 180-00020: Resistor 0 ohm 1/16W 0402; Manufacturer 1: Yageo; Manufacturer Part Number 1: RC0402FR-070RL; Part Name: RES SMD 0.0 OHM JUMPER 1/16W 0402; Item Phase: In Production; Tolerance: None; Use in new designs: Yes; Part Number: 180-00020; Supplier 1: Digi-Key; Supplier Part Number 1: 311-0.0LRCT-ND; Manufacturer 2: Hong Kong Resistors Manufactory; Manufacturer Part Number 2: RCT020RLF; Supplier 2: None; Supplier Part Number 2: None; Height: 0.40mm; Max Operating Temp: 155; Min Operating Temp: -55; Pins: 2; Power: 1/16W; Revision: 0E; Voltage: N/A; UBX Code: None
R16 R17 R19 R20 R31 R32 R34 R47 R49 = 180-00054: as R60 on sheet C210_0002_NORA_Module_220601; Part Number: 180-00054; Supplier 1: Digi-Key; Supplier Part Number 1: 1276-3433-1-ND; Manufacturer 2: Hong Kong Resistors Manufactory; Manufacturer Part Number 2: RCT021MFLF; Supplier 2: None; Supplier Part Number 2: None; Height: 0.4mm; Max Operating Temp: 155; Min Operating Temp: -55; Pins: 2; Power: 1/16W; Revision: 0D; UBX Code: None
R21 R23-R25 R28 = 180-00098: as R38 on sheet C210_0002_NORA_Module_220601; Part Number: 180-00098; Part_Type: Resistor; Supplier 1: Digi-Key; Supplier Part Number 1: P220JCT-ND; Arena Link: https://app.bom.com/a/8Q9HNUDUDWVBJC30?v=spec.summary; Pins: 2; Power: 1/16W; Revision: 0C; Manufacturer 2: Samsung Electro-Mechanics America, Inc; Manufacturer P/N 2: RC1005J221CS; Supplier 2: Digi-Key; Supplier Part Number 2: 1276-4360-1-ND; Alternate Footprint Ref: RES 0402; Height: 0.4mm
R119-R121 = 180-00144: RES SMD 150 OHM 1% 1/16W 0402; Manufacturer 1: Yageo; Manufacturer Part Number 1: RC0402FR-07150RL; Item Phase: Unreleased; Tolerance: +/- 1%; Use in new designs: Yes; Voltage: None; Part Number: 180-00144; Supplier 1: Digi-Key; Supplier Part Number 1: 311-150LRCT-ND; Manufacturer 2: None; Manufacturer Part Number 2: None; Supplier 2: None; Supplier Part Number 2: None; Height: 0.4mm; Max Operating Temp: 155; Min Operating Temp: -55; Part Name: RES SMD 150 OHM 1% 1/16W 0402; Pins: 2; Power: 1/16W; Revision: None; UBX Code: None
TP1 TP10 TP11 TP13-TP22 = TP_R: as TP23 on sheet C210_0002_NORA_Module_220601; Size: 1.0mm; Height: 0; DNP: DNP; Added Date: 2/1/2015; Checked By: Paul B; Checked Date: 2/5/2015
U1 = SARA-R5: GSM/GPRS and GSM/EGPRS/HSPA Cellular Module; Manufacturer: u-blox; Part Description: GSM/EGPRS/HSPA module; Value: SARA-R5
U2 = NX3DV2567: IC, ANLG SWITCH, 4PDT, SIM OPTIMIZED, 1.4V-4.3V, SMT, XQFN-16, 2.6mmX1.8mm; Manufacturer 1: NXP USA Inc.; Manufacturer Part Number 1: NX3DV2567GU,115; Current: None; Item Phase: In Production; Use in new designs: Yes; Part Number: NX3DV2567; Body Size: 2.6mm x 1.8mm; Height: 1mm; MFG Package: XQFN-16; Max Operating Temp: 85; Min Operating Temp: -40; Part Name: NX3DV2567GU,115; Pins: 16; Revision: 0A; Voltage: 1.4V-4.3V; UBX Code: None
U4 U5 = 225-00011: as U9 on sheet C210_0002_NORA_Module_220601; Manufacturer P/N: *; Part Number: 225-00011; Supplier 1: Digi-Key; Supplier Part Number 1: 568-9220-1-ND; Height: 1mm; Logic Type: Level Translator; MFG Package: 16-DHVQFN; Max Operating Temp: 125; Min Operating Temp: -40; Pins: 16; Revision: 0B; Use in new designs: Yes; Manufacturer 2: ON Semiconductor; Manufacturer Part Number 2: FXL4TD245BQX; Supplier 2: Digi-Key; Supplier Part Number 2: FXL4TD245BQXCT-ND
Z1 = 120-00079: CAP CER 3.3PF 50V +/-0.25pF NP0 0402; Manufacturer 1: Murata Electronics North America; Manufacturer Part Number 1: GRM1555C1H3R3CA01D; Item Phase: In Production; Tolerance: Other; Use in new designs: Yes; UBX Code: None; Part Number: 120-00079; Supplier 1: Digi-Key; Supplier Part Number 1: 490-5938-1-ND; Manufacturer 2: Samsung Electro-Mechanics America, Inc; Manufacturer Part Number 2: CL05C3R3CB5NNNC; Supplier 2: Digi-Key; Supplier Part Number 2: 1276-1141-1-ND; Height: 0.55mm; Max Operating Temp: 125; Min Operating Temp: -55; Part Name: CAP CER 3.3PF 50V +/-0.25pF NP0 0402; Pins: 2; Revision: 0A; Temperature Coefficient: NP0; Voltage: 50V
Z2 = 150-00010: INDUCTOR 10NH 300MA 0402; Manufacturer 1: Murata Electronics North America; Manufacturer Part Number 1: LQG15HS10NJ02D; Body Size: None; Item Phase: In Production; Tolerance: +/- 5%; Use in new designs: Yes; Part Number: 150-00010; Supplier 1: Digi-Key; Supplier Part Number 1: 490-2623-1-ND; Current: None; Height: 0.55mm; Isat: 300mA; Max Operating Temp: 125; Min Operating Temp: -55; Part Name: INDUCTOR 10NH 300MA 0402; Pins: 2; Revision: 0A; Voltage: None; UBX Code: None; Manufacturer 2: None; Manufacturer Part Number 2: None; Supplier 2: None; Supplier Part Number 2: None

## Sheet C210_0006_Power_220601.SchDoc: C210_0006_Power
size B; Date: 2/26/2021; CompanyName: U-blox; DrawnBy: EMOO; Engineer: EMOO; Organization: U-blox; Address1: 2601 25th St. SE; Address2: Salem, OR 97302; SheetNumber: 6; SheetTotal: 7; Website: www.u-blox.com; SheetSize: B; SheetTitle: C-210 Power
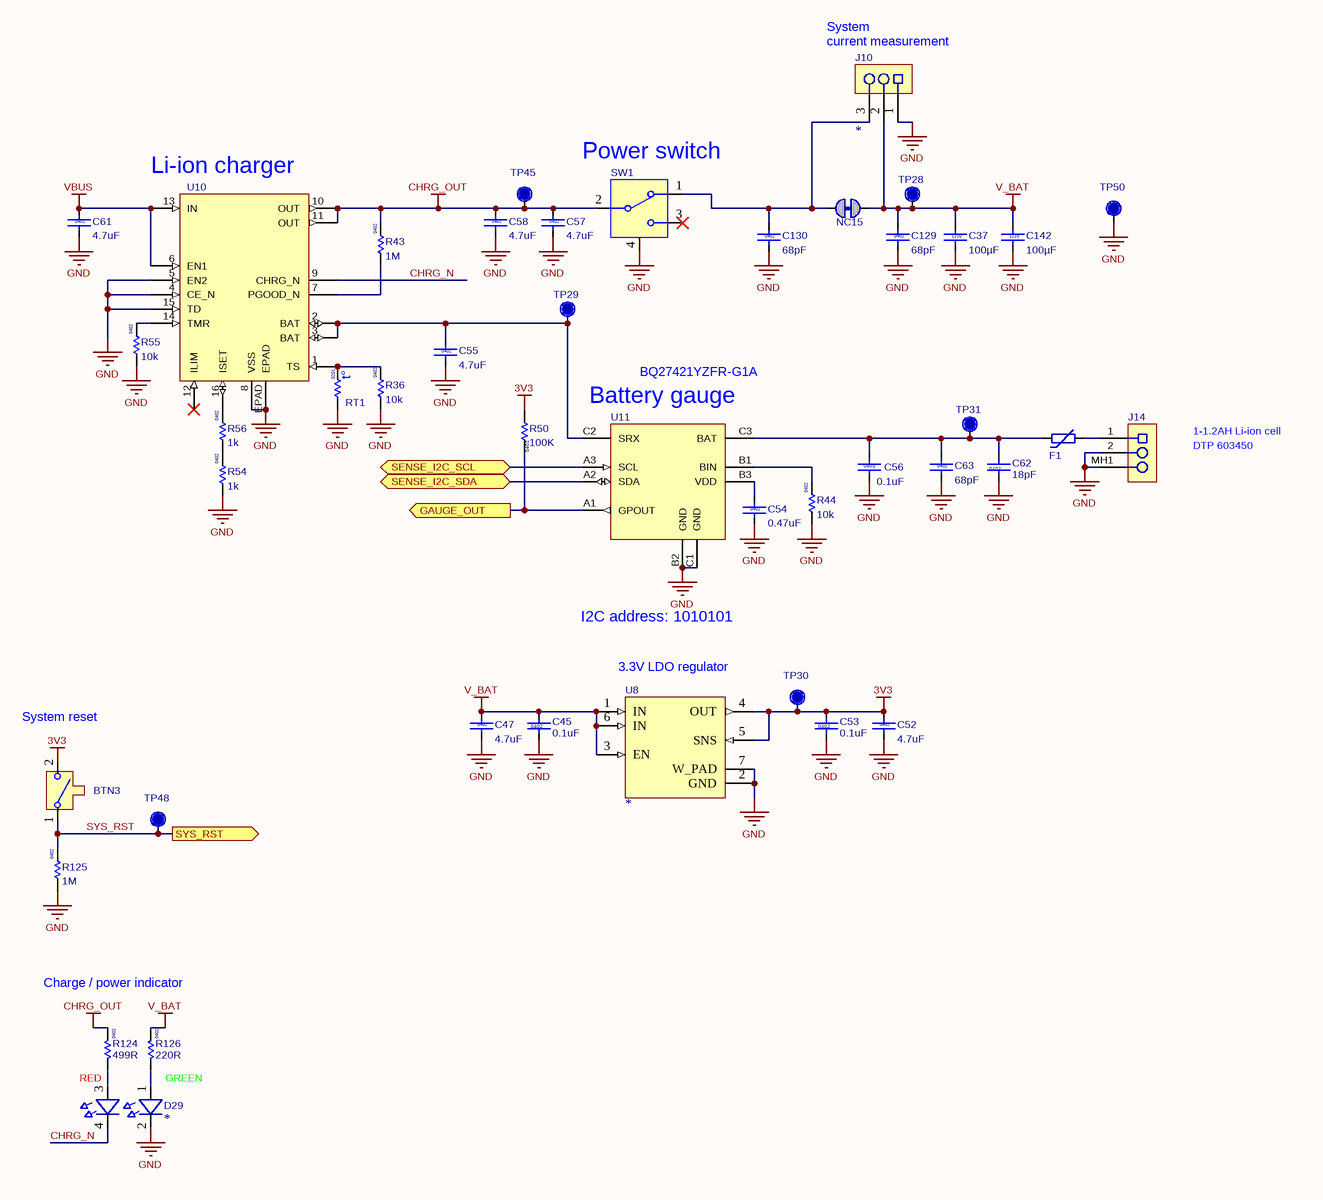
[diagram p3: C210_0006_Power_220601.SchDoc]

### Parts
(Parts that share a designator on the sheet are numbered #1, #2 ... from top to bottom, then left to right.)
?#5  (no value)  (graphical)
BTN3  (no value)  [B3U-3000P]
C37  value 100µF  Size: 1210  [Cap 1210]
C45  value 0.1uF  Size: 0402  [Cap 0402 HD]  (hidden comment: 120-000160.1uF)
C47  value 4.7uF  Size: 0402  [Cap 0402 HD]
C52  value 4.7uF  Size: 0402  [Cap 0402 HD]
C53  value 0.1uF  Size: 0402  [Cap 0402 HD]  (hidden comment: 120-000160.1uF)
C54  value 0.47uF  Size: 0402  [Cap 0402 HD]
C55  value 4.7uF  Size: 0402  [Cap 0402 HD]
C56  value 0.1uF  Size: 0402  [Cap 0402 HD]  (hidden comment: 120-000160.1uF)
C57  value 4.7uF  Size: 0402  [Cap 0402 HD]
C58  value 4.7uF  Size: 0402  [Cap 0402 HD]
C61  value 4.7uF  Size: 0402  [Cap 0402 HD]
C62  value 18pF  Size: 0402  [Cap 0402 HD]
C63  value 68pF  Size: 0402  [Cap 0402 HD]
C129  value 68pF  Size: 0402  [Cap 0402 HD]
C130  value 68pF  Size: 0402  [Cap 0402 HD]
C142  value 100µF  Size: 1210  [Cap 1210]
D29  (no value)  [LED_4Pin_4213_RA_3215]
F1  (no value)  [Fuse 1206]
J10  (no value)  [HDR-0.1P-3Pin-1Row-SMT]
J14  (no value)  [S2B-PH-SM4-TB]
NC15  Solderbridge-ShortDNP  [Solderbridge-Short]  (value not drawn)  (net tie, no BOM)
R36  value 10k  Size: 0402  [RES 0402 HD]
R43  value 1M  Size: 0402  [RES 0402 HD]
R44  value 10k  Size: 0402  [RES 0402 HD]
R50  value 100K  Size: 0402  [RES 0402 HD]
R54  value 1k  Size: 0402  [RES 0402 HD]
R55  value 10k  Size: 0402  [RES 0402 HD]
R56  value 1k  Size: 0402  [RES 0402 HD]
R124  value 499R  Size: 0402  [RES 0402 HD]
R125  value 1M  Size: 0402  [RES 0402 HD]
R126  value 220R  Size: 0402  [RES 0402 HD]
RT1  Size: 0201  [RES 0201 HD]  (hidden comment: Res Thermal)
SW1  (no value)  [EG1224]
TP28  TP  [TP12R]  (value not drawn)  (no BOM)
TP29  TP  [TP12R]  (value not drawn)  (no BOM)
TP30  TP  [TP12R]  (value not drawn)  (no BOM)
TP31  TP  [TP12R]  (value not drawn)  (no BOM)
TP45  TP  [TP12R]  (value not drawn)  (no BOM)
TP48  TP  [TP12R]  (value not drawn)  (no BOM)
TP50  TP  [TP12R]  (value not drawn)  (no BOM)
U8  (no value)  [DFN0.95P-6Pin_W-Pad]
U10  bq24230  [QFN0.5P3x3-16Pin_W-Pad]  (value not drawn)
U11  (no value)  [BQ27421]

### Ports
GAUGE_OUT (out), SENSE_I2C_SCL (bidir), SENSE_I2C_SDA (bidir), SYS_RST (out)

### Nets
3V3: BTN3.2 C52.1 C53.2 R50.1 TP30.1 U8.4(OUT) U8.5(SNS)
CHRG_OUT: C57.1 C58.1 R43.2 R124.2 SW1.2 TP45.1 U10.10(OUT) U10.11(OUT)
GND: C37.2 C45.1 C47.2 C52.2 C53.1 C54.2 C55.2 C56.1 C57.2 C58.2 C61.2 C62.1 C63.2 C129.2 C130.2 C142.2 D29.2(C1) J10.1 J14.2 J14.MH1 R36.1 R44.1 R54.1 R55.1 R125.1 RT1.2 SW1.4(GND) TP50.1 U8.2(GND) U8.7(W_PAD) U10.4(CE_N) U10.5(EN2) U10.8(VSS) U10.15(TD) U10.EPAD U11.B2(GND) U11.C1(GND)
V_BAT: C37.1 C45.2 C47.1 C129.1 C142.1 J10.2 NC15.1 R126.2 TP28.1 U8.1(IN) U8.3(EN) U8.6(IN)
VBUS: C61.1 U10.6(EN1) U10.13(IN)
CHRG_N: D29.4(C2) U10.9(CHRG_N)
SENSE_I2C_SCL: U11.A3(SCL) ; port SENSE_I2C_SCL
SENSE_I2C_SDA: U11.A2(SDA) ; port SENSE_I2C_SDA
SYS_RST: BTN3.1 R125.2 TP48.1 ; port SYS_RST
NetC54_1: C54.1 U11.B3(VDD)
NetC55_1: C55.1 TP29.1 U10.2(BAT) U10.3(BAT) U11.C2(SRX)
NetC56_2: C56.2 C62.2 C63.1 F1.1 TP31.1 U11.C3(BAT)
NetC130_1: C130.1 J10.3 NC15.2 SW1.1
NetD29_1: D29.1(A1) R126.1
NetD29_3: D29.3(A2) R124.1
NetF1_2: F1.2 J14.1
NetR36_2: R36.2 RT1.1 U10.1(TS)
NetR43_1: R43.1 U10.7(PGOOD_N)
NetR44_2: R44.2 U11.B1(BIN)
NetR50_2: R50.2 U11.A1(GPOUT) ; port GAUGE_OUT
NetR54_2: R54.2 R56.1
NetR55_2: R55.2 U10.14(TMR)
NetR56_2: R56.2 U10.16(ISET)

Not connected (* = marked no-connect by the designer): SW1 3*; U10 12(ILIM)*

### Notes on the sheet
- System
- (near J10) current measurement
- (near SW1) Power switch
- (near U10) Li-ion charger
- BQ27421YZFR-G1A
- (near U11) Battery gauge
- DTP 603450
- 1-1.2AH Li-ion cell
- I2C address: 1010101
- (near BTN3) System reset
- (near U8) 3.3V LDO regulator
- Charge / power indicator
- RED
- GREEN
- Revision:
- Page:
- (in symbol 182-00002) t°

### Library data of the parts
?#5 = Sub_Title_Block: as ?#3 on sheet C210_0002_NORA_Module_220601
BTN3 = 135-00006: Button SPST-NO Off-MOM, 50mA 12V, Right Angle, SMT; Manufacturer 1: Omron Electronics Inc-EMC Div; Part Name: Button Tactile SPST-NO 50mA 3mm RA SMT; Body Size: 3.00mm x 2.50mm; Item Phase: In Production; Use in new designs: Yes; Voltage: 12VDC; UBX Code: None; Part Number: 135-00006; Manufacturer Part Number 1: B3U-3000P; Supplier 1: Digi-Key; Supplier Part Number 1: SW1022CT-ND; Current: 50mA; Height: 1.35mm; Max Operating Temp: 70; Min Operating Temp: -25; Pins: 2; Revision: 0A; Manufacturer 2: None; Manufacturer Part Number 2: None; Supplier 2: None; Supplier Part Number 2: None
C37 C142 = 120-00223: as C26 on sheet C210_0003_SARA_Module_220601; Part Number: 120-00223; Supplier 1: Future Electronics; Supplier Part Number 1: Samsung Electro-Mechanics America, Inc. CL32A107MPVNNNE; Manufacturer 2: None; Manufacturer Part Number 2: None; Supplier 2: None; Supplier Part Number 2: None; Height: 2.8mm; Max Operating Temp: 85; Min Operating Temp: -55; Pins: 2; Revision: 0A; Temperature Coefficient: X5R; Voltage: 10V
C45 C53 C56 = 120-00016: as C39 on sheet C210_0002_NORA_Module_220601; Part Number: 120-00016; Revision: 0A; Supplier 1: Digi-Key; Supplier Part Number 1: 490-6297-1-ND; Manufacturer 2: Yageo; Manufacturer P/N 2: CC0402KRX5R6BB104; Supplier 2: Digi-Key; Supplier Part Number 2: 311-1336-1-ND; Arena Link: https://app.bom.com/a/GYHPV2L2L43KRMBK?v=spec.summary; Height: 0.55mm; Pins: 2; Temperature Coefficient: X5R; Voltage: 10V
C47 C52 C55 C57 C58 C61 = 120-00020: as C3 on sheet C210_0003_SARA_Module_220601; Part Number: 120-00020; Supplier 1: Digi-Key; Supplier Part Number 1: 1276-1482-1-ND; Manufacturer 2: Yageo; Manufacturer Part Number 2: CC0402KRX5R6BB475; Supplier 2: Digi-Key; Supplier Part Number 2: 311-3477-1-ND; Height: 0.55mm; Max Operating Temp: 85; Min Operating Temp: -55; Pins: 2; Revision: 0C; Temperature Coefficient: X5R; Voltage: 10V
C54 = 120-00072: Cap, Ceramic, 0.47UF 10V 10% X5R 0402; Manufacturer 1: Murata Electronics North America; Manufacturer Part Number 1: GRM155R61A474KE15J; Part Name: CAP CER 0.47UF 10V 10% X5R 0402; Item Phase: In Production; Tolerance: +/- 10%; Use in new designs: Yes; UBX Code: None; Part Number: 120-00072; Supplier 1: Digi-Key; Supplier Part Number 1: 490-6305-1-ND; Manufacturer 2: Samsung Electro-Mechanics America, Inc; Manufacturer Part Number 2: CL05A474KP5NNNC; Supplier 2: Digi-Key; Supplier Part Number 2: 1276-1173-1-ND; Height: 0.55mm; Max Operating Temp: 85; Min Operating Temp: -55; Pins: 2; Revision: 0A; Temperature Coefficient: X5R; Voltage: 10V
C62 = 120-00041: as C25 on sheet C210_0003_SARA_Module_220601; Part Number: 120-00041; Supplier 1: Arrow; Supplier Part Number 1: NMC0402NPO180J50TRPF; Manufacturer 2: CCK; Manufacturer Part Number 2: CCK0402NPO5J180PL; Supplier 2: None; Supplier Part Number 2: None; Height: 0.55mm; Max Operating Temp: 125; Min Operating Temp: -55; Pins: 2; Revision: 0C; Temperature Coefficient: NP0; Voltage: 50V
C63 C129 C130 = 120-00047: as C82 on sheet C210_0002_NORA_Module_220601; Part Number: 120-00047; Supplier 1: Digi-Key; Supplier Part Number 1: 490-8219-1-ND; Manufacturer 2: AVX Corporation; Manufacturer Part Number 2: 04025A680FAT2A; Supplier 2: Digi-Key; Supplier Part Number 2: 478-7881-1-ND; Height: 0.55mm; Max Operating Temp: 125; Min Operating Temp: -55; Pins: 2; Revision: None; Temperature Coefficient: NP0; Voltage: 50V
D29 = 115-00013: Dual LED, Red/Green, Right Angle, Dome 1208; Manufacturer 1: Dialight; Manufacturer Part Number 1: 5988510207F; Part Name: LED Red/Green RA SMT 1208; Body Size: 3.2mm x 1.5mm; Current: 20mA; Item Phase: In Production; MFG Package: 1208 Bi-color; Use in new designs: Yes; Voltage: None; Color: *; Part Number: 115-00013; Supplier 1: Digi-Key; Supplier Part Number 1: 350-2072-1-ND; Height: 1.0mm; Max Operating Temp: None; Min Operating Temp: None; Pins: 4; Revision: 0A; Size: None; UBX Code: None; Manufacturer 2: None; Manufacturer Part Number 2: None; Supplier 2: None; Supplier Part Number 2: None
F1 = 190-00005: Fuse, PTC 8V, 750mA, hold, 1.5A trip, 1206; Manufacturer 1: Littelfuse; Manufacturer Part Number 1: 1206L075THYR; Part Name: Fuse PTC 8V 750mA 1206; Body Size: None; Item Phase: Unreleased; MFG Package: 1206L; Use in new designs: Yes; Part Number: 190-00005; Supplier 1: Digi-Key; Supplier Part Number 1: F3370CT-ND; Current: 750mA; Height: 0.75mm; Max Operating Temp: 85; Min Operating Temp: -40; Pins: 2; Revision: None; Size: 1206; Voltage: None; UBX Code: None
J10 = 130-00105: as J4 on sheet C210_0002_NORA_Module_220601; Manufacturer P/N: *; Part Number: 130-00105; Supplier 1: Digi-Key; Supplier Part Number 1: 952-1951-ND; Diameter: None; Height: 9.93mm; Max Operating Temp: None; Min Operating Temp: None; Pins: 3; Revision: 0C; UBX Code: None; Manufacturer 2: Greenconn Corporation; Manufacturer Part Number 2: GPHC1010302A081B1BD; Supplier 2: Teamwise Limited; Supplier Part Number 2: Greenconn Corporation GPHC1010302A081B1BD
J14 = S2B-PH-SM4-TB: Conn, SMT, 0.079" Pitch, 2 Pin, R/A, Black; Item Phase: In Production; Use in new designs: Yes; Voltage: None; Part Number: S2B-PH-SM4-TB; Manufacturer Part Number 1: S2B-PH-SM4-TB; Supplier 1: None; Supplier Part Number 1: None; Diameter: None; Height: 5.5mm; Max Operating Temp: None; Min Operating Temp: None; Part Name: Conn, SMT, 0.079" Pitch, 2 Pin, R/A, Black; Pins: 2; Revision: 0A; UBX Code: None; Manufacturer 2: None; Manufacturer Part Number 2: None; Supplier 2: None; Supplier Part Number 2: None; Manufacturer P/N: *
NC15 = Solderbridge-Short: Added By: Paul B; Part Number: Solderbridge-Short; Height: 0; DNP: DNP; Added Date: 12/2/2015
R36 R44 R55 = 180-00024: as R1 on sheet C210_0003_SARA_Module_220601; Part Number: 180-00024; Supplier 1: Digi-Key; Supplier Part Number 1: 1276-3431-1-ND; Manufacturer 2: Hong Kong Resistors Manufactory; Manufacturer Part Number 2: RCT0210KFLF; Supplier 2: None; Supplier Part Number 2: None; Height: 0.4mm; Max Operating Temp: 155; Min Operating Temp: -55; Pins: 2; Power: 1/16W; Revision: 0E; Voltage: N/A
R43 R125 = 180-00054: as R60 on sheet C210_0002_NORA_Module_220601; Part Number: 180-00054; Supplier 1: Digi-Key; Supplier Part Number 1: 1276-3433-1-ND; Manufacturer 2: Hong Kong Resistors Manufactory; Manufacturer Part Number 2: RCT021MFLF; Supplier 2: None; Supplier Part Number 2: None; Height: 0.4mm; Max Operating Temp: 155; Min Operating Temp: -55; Pins: 2; Power: 1/16W; Revision: 0D; UBX Code: None
R50 = 180-00093: Resistor 100K ohm 1% 1/16W, 0402; Manufacturer 1: Yageo; Manufacturer Part Number 1: RC0402FR-07100KL; Part Name: RES SMD 100K ohm 1% 1/16W 0402; Item Phase: In Production; Tolerance: +/- 1%; Use in new designs: Yes; Voltage: None; Part Number: 180-00093; Supplier 1: Digi-Key; Supplier Part Number 1: 311-100KLRCT-ND; Manufacturer 2: Rohm Semiconductor; Manufacturer Part Number 2: MCR01MRTF1003; Supplier 2: Digi-Key; Supplier Part Number 2: RHM100KCDCT-ND; Height: 0.4mm; Max Operating Temp: 155; Min Operating Temp: -55; Pins: 2; Power: 1/16W; Revision: 0B; UBX Code: None
R54 R56 = 180-00021: Resistor 1k ohm 1% 1/16W, 0402; Manufacturer 1: Hong Kong Resistors Manufactory; Manufacturer Part Number 1: RCT021KFLF; Part Name: RES SMD 1K OHM 1% 1/16W 0402; Item Phase: In Production; Tolerance: +/- 1%; Use in new designs: Yes; Voltage: None; Part Number: 180-00021; Supplier 1: None; Supplier Part Number 1: None; Manufacturer 2: Yageo; Manufacturer Part Number 2: RC0402FR-071KL; Supplier 2: Digi-Key; Supplier Part Number 2: 311-1.00KLRCT-ND; Height: 0.4mm; Max Operating Temp: 155; Min Operating Temp: -55; Pins: 2; Power: 1/16W; Revision: 0E; UBX Code: None
R124 = 180-00031: as R62 on sheet C210_0002_NORA_Module_220601; Part Number: 180-00031; Part_Type: Resistor; Supplier 1: Digi-Key; Supplier Part Number 1: RHM499CDCT-ND; Manufacturer 2: Samsung Electro-Mechanics America, Inc; Manufacturer P/N 2: RC1005F4990CS; Arena Link: https://app.bom.com/a/Q8RZ5CVCVEDU1SS5?v=spec.summary; Height: 0.4mm; Pins: 2; Power: 1/16W; Revision: 0D; Supplier 2: Digi-Key; Supplier Part Number 2: 1276-3992-1-ND; Alternate Footprint Ref: RES 0402
R126 = 180-00098: as R38 on sheet C210_0002_NORA_Module_220601; Part Number: 180-00098; Part_Type: Resistor; Supplier 1: Digi-Key; Supplier Part Number 1: P220JCT-ND; Arena Link: https://app.bom.com/a/8Q9HNUDUDWVBJC30?v=spec.summary; Pins: 2; Power: 1/16W; Revision: 0C; Manufacturer 2: Samsung Electro-Mechanics America, Inc; Manufacturer P/N 2: RC1005J221CS; Supplier 2: Digi-Key; Supplier Part Number 2: 1276-4360-1-ND; Alternate Footprint Ref: RES 0402; Height: 0.4mm
RT1 = 182-00002: Thermistor, 10Kohm, NTC 5%, 0201, 0.6mm x 0.3mm; Manufacturer 1: Murata Electronics North America; Manufacturer Part Number 1: NCP03XH103J05RL; Part Name: Thermistor 10k Ohm 5% 3380K 0201; Item Phase: Unreleased; Power: 1/20W; Tolerance: +/- 5%; Use in new designs: Yes; Value: 10k; Voltage: None; Part Number: 182-00002; Supplier 1: Digi-Key; Supplier Part Number 1: 490-4644-1-ND; Body Size: 0.6mm x 0.3mm; Height: 0.26mm; Max Operating Temp: 125; Min Operating Temp: -40; Pins: 2; Revision: None; UBX Code: None
SW1 = 137-00002: Slide switch, SPDT, 3 Pin, 500mA, 15V, Through Hole; Manufacturer 1: E-Switch; Part Name: Switch Slide SPDT 500mA 13.8mm RA TH; Item Phase: Unreleased; Use in new designs: Yes; UBX Code: None; Part Number: 137-00002; Manufacturer Part Number 1: EG1224; Supplier 1: Digi-Key; Supplier Part Number 1: EG2585-ND; Current: 500mA; Height: 8.5mm; Max Operating Temp: 70; Min Operating Temp: -20; Pins: 3; Revision: None; Voltage: 15V; Manufacturer 2: None; Manufacturer Part Number 2: None; Supplier 2: None; Supplier Part Number 2: None
TP28-TP31 TP45 TP48 TP50 = TP_R: as TP23 on sheet C210_0002_NORA_Module_220601; Size: 1.0mm; Height: 0; DNP: DNP; Added Date: 2/1/2015; Checked By: Paul B; Checked Date: 2/5/2015
U8 = 260-00045: IC REG LDO 3.3V 1A 6DFN; Manufacturer 1: ON Semiconductor; Body Size: 3mm x 3mm; Item Phase: Unreleased; Reg Outputs: None; MFG Package: 6-VDFN Exposed Pad; SMT Pitch: 0.95mm; Thermal Pad: Yes; Manufacturer P/N: *; Part Number: 260-00045; Manufacturer Part Number 1: NCP692MN33T2G; Supplier 1: Digi-Key; Supplier Part Number 1: NCP692MN33T2GOSTR-ND; Current: 1A; Height: 1mm; Max Operating Temp: 85; Min Operating Temp: -40; Part Name: NCP692MN33T2G; Pins: 6; Revision: None; Use in new designs: Yes; Voltage: 3.3V; UBX Code: None; Manufacturer 2: None; Manufacturer Part Number 2: None; Supplier 2: None; Supplier Part Number 2: None
U10 = bq24230: BAT CHARGER, Li-ION, SMT, USB, PWR PATH, 500mA, 4.4V, 3mmx3mm QFN-16; Manufacturer 1: Texas Instruments; Body Size: 3.3mm x 3.3mm; Item Phase: Unreleased; MFG Package: VQFN-16; SMT Pitch: 0.5mm; Use in new designs: Yes; Voltage: 5-6.5V; UBX Code: None; Part Number: bq24230; Manufacturer Part Number 1: bq24230; Supplier 1: Digi-key; Supplier Part Number 1: 296-23937-2-ND; Height: 1mm; Max Operating Temp: 85; Min Operating Temp: -40; Pins: 16; Revision: None; Size: Other; Manufacturer 2: None; Manufacturer Part Number 2: None; Supplier 2: None; Supplier Part Number 2: None
U11 = BQ27421: IC, SMT, BATTERY GAUGE, INGLE CELL Li-ION, COULOMB COUNTER, DSBGA-9 1.6mmX1.6mm; Manufacturer 1: Texas Instruments; Part Name: B39162B4353P810; Body Size: 1.4mm x 1.1mm; Current: None; Item Phase: In Production; MFG Package: QCS5P; Use in new designs: Yes; Part Number: BQ27421; Manufacturer Part Number 1: BQ27421; Height: 0.45mm; Max Operating Temp: 85; Min Operating Temp: -40; Pins: 5; Revision: 0A; Voltage: N/A; UBX Code: None